# Altium project CoffeeScale.PrjPcb
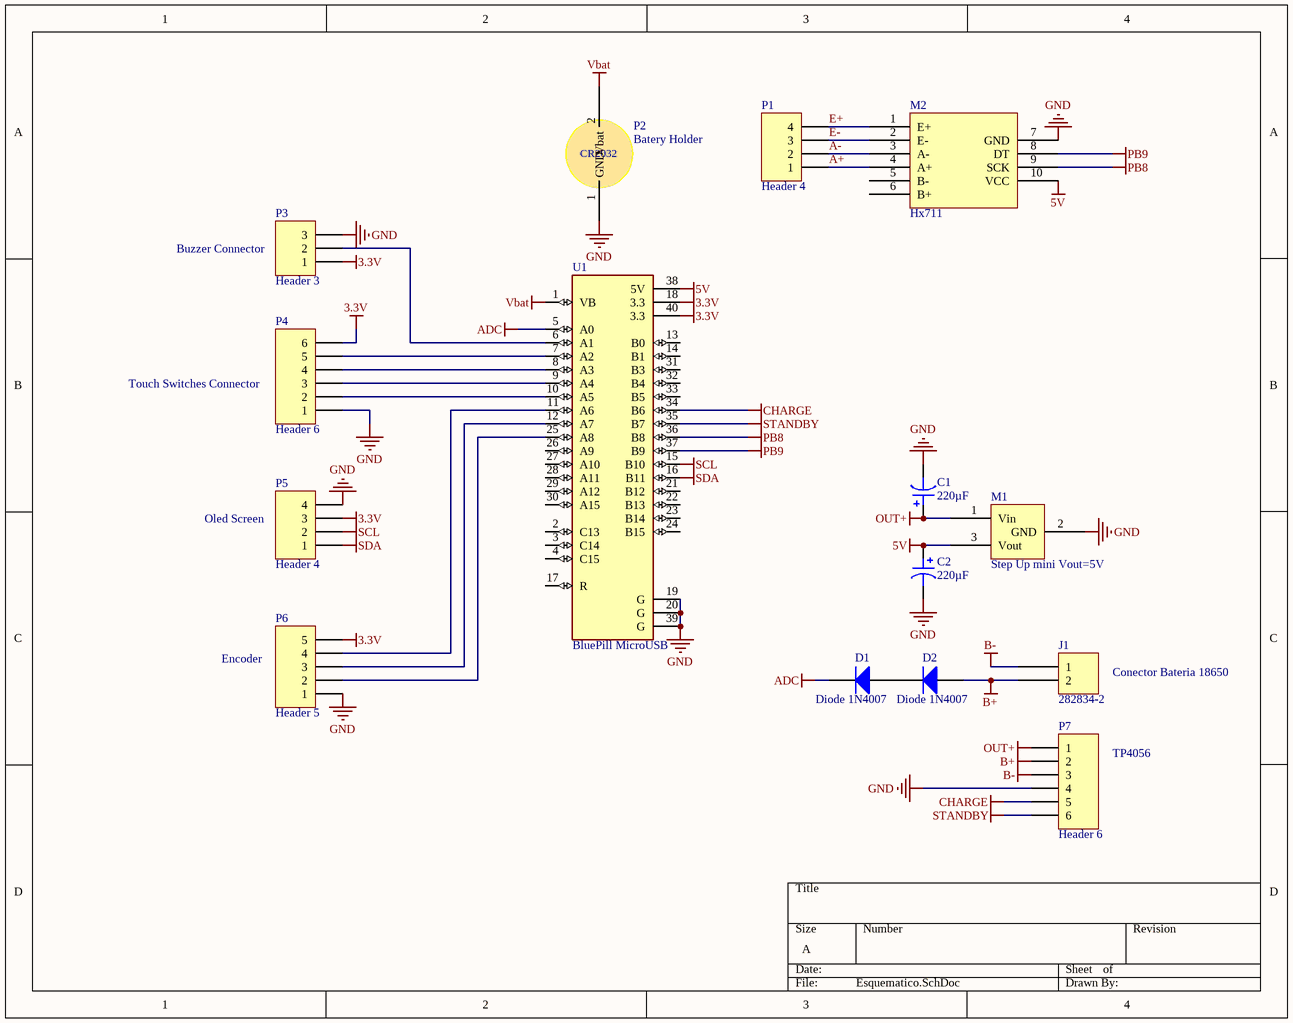
[diagram p0: Esquematico.SchDoc]
1 sheet, 15 parts. Net scope: global (net labels, ports and power ports of the same name join across sheets).
Board file: PCB.PcbDoc

## Sheet Esquematico.SchDoc
size A

### Parts
C1  220µF  [CAP TH ALUM ELEC D10.00mm S5.00mm H12.50mm]
C2  220µF  [CAP TH ALUM ELEC D10.00mm S5.00mm H12.50mm]
D1  Diode 1N4007  [DO-41]
D2  Diode 1N4007  [DO-41]
J1  282834-2  [TE 282834-2]
M1  Step Up mini Vout=5V  [StepUp Mini 5V]
M2  Hx711  [HX711]
P1  Header 4  [HDR1X4]
P2  Batery Holder  [20mm Cell Holder]
P3  Header 3  [HDR1X3]
P4  Header 6  [HDR1X6]
P5  Header 4  [HDR1X4]
P6  Header 5  [HDR1X5]
P7  Header 6  [HDR1X6]
U1  BluePill MicroUSB  [MODULE_ZC323000]

### Nets
3.3V: P3.1 P4.6 P5.3 P6.5 U1.18(3.3) U1.40(3.3)
5V: C2.1 M1.3(Vout) M2.10(VCC) U1.38(5V)
ADC: D1.2(K) U1.5(A0)
B+: D2.1(A) J1.2 P7.2
B-: J1.1 P7.3
CHARGE: P7.5 U1.34(B6)
GND: C1.2 C2.2 M1.2(GND) M2.7(GND) P2.1(GND) P3.3 P4.1 P5.4 P6.1 P7.4 U1.19(G) U1.20(G) U1.39(G)
OUT+: C1.1 M1.1(Vin) P7.1
PB8: M2.9(SCK) U1.36(B8)
PB9: M2.8(DT) U1.37(B9)
SCL: P5.2 U1.15(B10)
SDA: P5.1 U1.16(B11)
STANDBY: P7.6 U1.35(B7)
Vbat: P2.2(Vbat) U1.1(VB)
A+: M2.4(A+) P1.1
A-: M2.3(A-) P1.2
E+: M2.1(E+) P1.4
E-: M2.2(E-) P1.3
NetD1_1: D1.1(A) D2.2(K)
NetP3_2: P3.2 U1.6(A1)
NetP4_2: P4.2 U1.10(A5)
NetP4_3: P4.3 U1.9(A4)
NetP4_4: P4.4 U1.8(A3)
NetP4_5: P4.5 U1.7(A2)
NetP6_2: P6.2 U1.25(A8)
NetP6_3: P6.3 U1.12(A7)
NetP6_4: P6.4 U1.11(A6)

Not connected (* = marked no-connect by the designer): M2 5(B-) 6(B+); U1 2(C13) 3(C14) 4(C15) 13(B0) 14(B1) 17(R) 21(B12) 22(B13) 23(B14) 24(B15) 26(A9) 27(A10) 28(A11) 29(A12) 30(A15) 31(B3) 32(B4) 33(B5)

### Notes on the sheet
- (near P3) Buzzer Connector
- (near P4) Touch Switches Connector
- (near P5) Oled Screen
- (near P6) Encoder
- Conector Bateria 18650
- TP4056
- (in symbol Component_1) CR2032

### Library data of the parts
C1 C2 = UVZ1H221MPD: CAP ALUM 220UF 20% 50V RADIAL; manufacturer: Nichicon; Lifetime @ Temp.: 1000 Hrs @ 105°C; Polarization: Polar; Ripple Current @ High Frequency: 450mA @ 10kHz; Ripple Current @ Low Frequency: 300mA @ 120Hz; Part Number: UVZ1H221MPD; Applications: General Purpose; Capacitance: 220µF; componentlink1description: Datasheet; componentlink1url: http://nichicon-us.com/english/products/pdfs/e-uvz.pdf; componentlink2description: DigiKey Link; componentlink2url: http://digikey.com/product-detail/en/nichicon/UVZ1H221MPD/493-1342-ND/589083; Device Package: Radial, Can; Height - Seated (Max): 0.492" (12.50mm); lastupdated: 2/9/2020 01:31:04; Lead Spacing: 0.197" (5.00mm); Lifecycle Status: Active; Minimum Order: 1; Mounting Type: Through Hole; Operating Temperature: -55°C ~ 105°C; Package / Case: Radial, Can; packaging: Bulk; partid: 10709; Part Status: Active; price: 0.41; series: UVZ; Size / Dimension: 0.394" Dia (10.00mm); Supplier 1: DigiKey; Supplier Part Number 1: 493-1342-ND; Tolerance: ±20%; value: 220µF; Voltage - Rated: 50V
D1 D2 = Diode 1N4007: 1 Amp General Purpose Rectifier; Published: 8-Jun-2000; LatestRevisionDate: 17-Jul-2002; LatestRevisionNote: Re-released for DXP Platform.; DatasheetVersion: 1998; PackageVersion: Aug-1999; PackageReference: DO-41; Publisher: Altium Limited; PackageDescription: Diode, Axial; Body 5.2 x 2.7 mm (LxDia. max), Lead Dia. 0.86 mm (max); Code_JEDEC: DO-204-AL; ComponentLink1Description: Manufacturer Link; ComponentLink1URL: http://www.fairchildsemi.com/; ComponentLink2Description: Datasheet; ComponentLink2URL: http://www.fairchildsemi.com/ds/1N%2F1N4001.pdf
J1 = 282834-2: TERM BLK 2P SIDE ENT 2.54MM PCB; Manufacturer: TE Connectivity AMP Connectors; Current: 10A; Mating Orientation: Horizontal with Board; Number of Levels: 1; Pitch: 0.100" (2.54mm); Positions Per Level: 2; Voltage: 150V; Wire Gauge: 16-30 AWG; Wire Termination: Screw - Rising Cage Clamp; Part Number: 282834-2; Color: Green; ComponentLink1Description: Datasheet; ComponentLink1URL: https://www.te.com/commerce/DocumentDelivery/DDEController?Action=srchrtrv&DocNm=282834&DocType=Customer+Drawing&DocLang=English; ComponentLink2Description: DigiKey Link; ComponentLink2URL: http://digikey.com/product-detail/en/te-connectivity-amp-connectors/282834-2/A98333-ND/1150135; LastUpdated: 15/1/2020 04:15:38; Lifecycle Status: Active; Minimum Order: 1; Mounting Type: Through Hole; Packaging: Bulk; Part Status: Active; Price: 0.88; Series: Buchanan; Supplier 1: DigiKey; Supplier Part Number 1: A98333-ND
M1 = StepUp 5V
P1 P5 = Header 4: Header, 4-Pin; LatestRevisionDate: 17-Jul-2002; LatestRevisionNote: Re-released for DXP Platform.; Publisher: Altium Limited
P2 = Component_1
P3 = Header 3: Header, 3-Pin; LatestRevisionDate: 17-Jul-2002; LatestRevisionNote: Re-released for DXP Platform.; Publisher: Altium Limited
P4 P7 = Header 6: Header, 6-Pin; LatestRevisionDate: 17-Jul-2002; LatestRevisionNote: Re-released for DXP Platform.; Publisher: Altium Limited
P6 = Header 5: Header, 5-Pin; LatestRevisionDate: 17-Jul-2002; LatestRevisionNote: Re-released for DXP Platform.; Publisher: Altium Limited
U1 = ZC323000: STM32F103C8T6 ARM STM32 Minimum System Development Board Module For Arduino; Package: None; MP: ZC323000; Value: *; Availability: Unavailable; Price: None